# EAGLE design TesteTouchScreenadaptador28 (EAGLE 6.2)
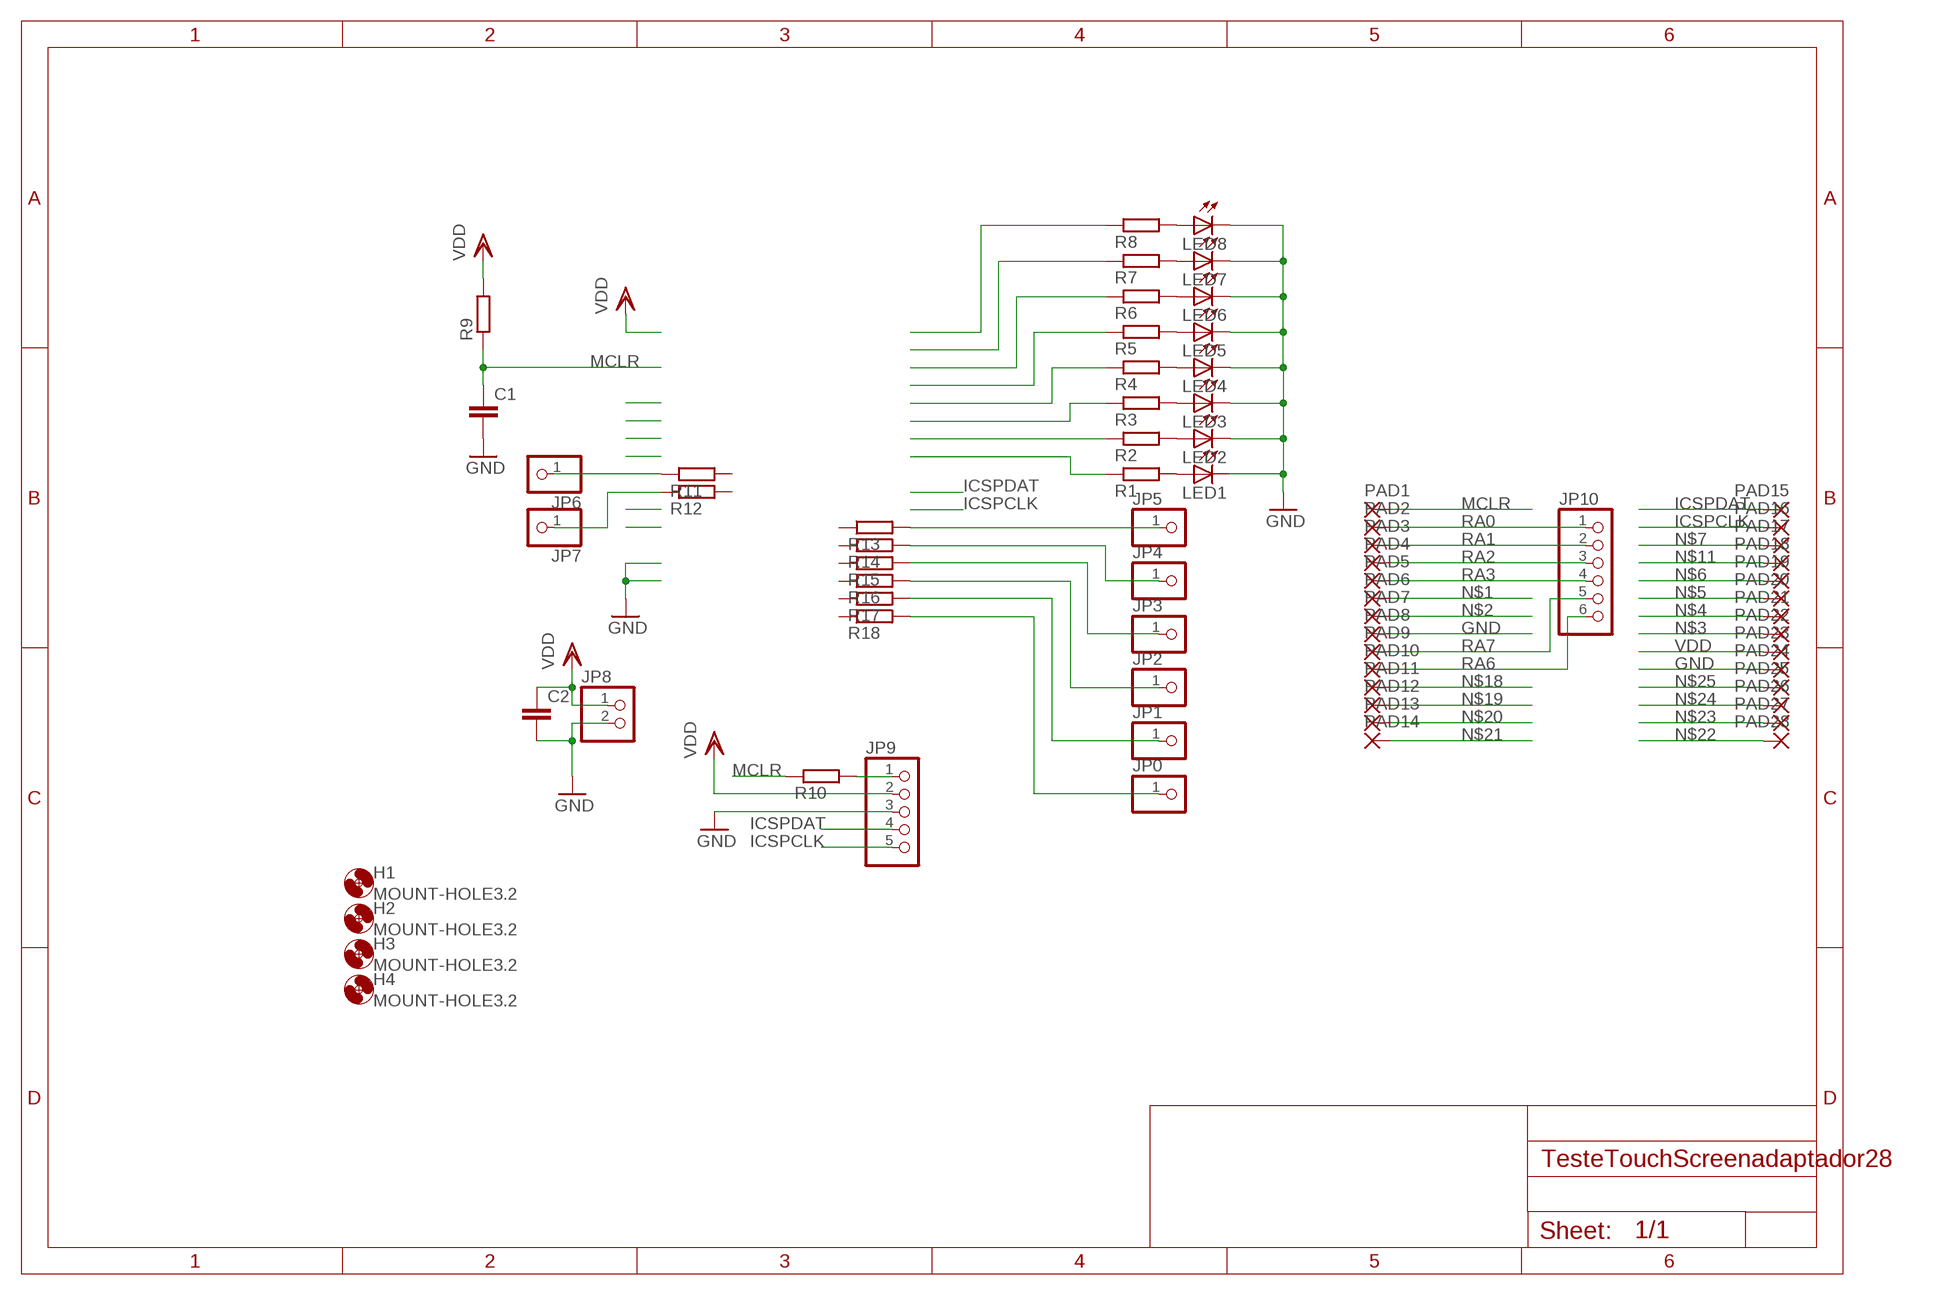
[diagram p0: schematic, sheet 1]

## Parts
C1  C-EUC1206  [C1206]
C2  C-EUC1206  [C1206]
H1  MOUNT-HOLE3.2  [3,2]
H2  MOUNT-HOLE3.2  [3,2]
H3  MOUNT-HOLE3.2  [3,2]
H4  MOUNT-HOLE3.2  [3,2]
JP0  PINHD-1X1  [1X01]
JP1  PINHD-1X1  [1X01]
JP2  PINHD-1X1  [1X01]
JP3  PINHD-1X1  [1X01]
JP4  PINHD-1X1  [1X01]
JP5  PINHD-1X1  [1X01]
JP6  PINHD-1X1  [1X01]
JP7  PINHD-1X1  [1X01]
JP8  PINHD-1X2  [1X02]
JP9  PINHD-1X5  [1X05]
JP10  PINHD-1X6  [1X06]
LED1  LED5MM  [LED5MM]
LED2  LED5MM  [LED5MM]
LED3  LED5MM  [LED5MM]
LED4  LED5MM  [LED5MM]
LED5  LED5MM  [LED5MM]
LED6  LED5MM  [LED5MM]
LED7  LED5MM  [LED5MM]
LED8  LED5MM  [LED5MM]
PAD1  SMD2  [SMD1,27-2,54]
PAD2  SMD2  [SMD1,27-2,54]
PAD3  SMD2  [SMD1,27-2,54]
PAD4  SMD2  [SMD1,27-2,54]
PAD5  SMD2  [SMD1,27-2,54]
PAD6  SMD2  [SMD1,27-2,54]
PAD7  SMD2  [SMD1,27-2,54]
PAD8  SMD2  [SMD1,27-2,54]
PAD9  SMD2  [SMD1,27-2,54]
PAD10  SMD2  [SMD1,27-2,54]
PAD11  SMD2  [SMD1,27-2,54]
PAD12  SMD2  [SMD1,27-2,54]
PAD13  SMD2  [SMD1,27-2,54]
PAD14  SMD2  [SMD1,27-2,54]
PAD15  SMD2  [SMD1,27-2,54]
PAD16  SMD2  [SMD1,27-2,54]
PAD17  SMD2  [SMD1,27-2,54]
PAD18  SMD2  [SMD1,27-2,54]
PAD19  SMD2  [SMD1,27-2,54]
PAD20  SMD2  [SMD1,27-2,54]
PAD21  SMD2  [SMD1,27-2,54]
PAD22  SMD2  [SMD1,27-2,54]
PAD23  SMD2  [SMD1,27-2,54]
PAD24  SMD2  [SMD1,27-2,54]
PAD25  SMD2  [SMD1,27-2,54]
PAD26  SMD2  [SMD1,27-2,54]
PAD27  SMD2  [SMD1,27-2,54]
PAD28  SMD2  [SMD1,27-2,54]
R1  R-EU_R0805  [R0805]
R2  R-EU_R0805  [R0805]
R3  R-EU_R0805  [R0805]
R4  R-EU_R0805  [R0805]
R5  R-EU_R0805  [R0805]
R6  R-EU_R0805  [R0805]
R7  R-EU_R0805  [R0805]
R8  R-EU_R0805  [R0805]
R9  R-EU_R0805  [R0805]
R10  R-EU_R0805  [R0805]
R11  R-EU_R0805  [R0805]
R12  R-EU_R0805  [R0805]
R13  R-EU_R0805  [R0805]
R14  R-EU_R0805  [R0805]
R15  R-EU_R0805  [R0805]
R16  R-EU_R0805  [R0805]
R17  R-EU_R0805  [R0805]
R18  R-EU_R0805  [R0805]

## Nets
GND: C1.2 C2.2 JP8.2 JP9.3 LED1.K(C) LED2.K(C) LED3.K(C) LED4.K(C) LED5.K(C) LED6.K(C) LED7.K(C) LED8.K(C) PAD8.1(P) PAD24.1(P)
ICSPCLK: JP9.5 PAD16.1(P)
ICSPDAT: JP9.4 PAD15.1(P)
MCLR: C1.1 PAD1.1(P) R9.1 R10.1
N$1: JP6.1 PAD6.1(P) R11.1
N$2: JP7.1 PAD7.1(P) R12.1
N$3: JP0.1 PAD22.1(P) R18.2
N$4: JP1.1 PAD21.1(P) R17.2
N$5: JP2.1 PAD20.1(P) R16.2
N$6: JP3.1 PAD19.1(P) R15.2
N$7: JP5.1 PAD17.1(P) R13.2
N$9: LED1.A R1.2
N$10: LED2.A R2.2
N$11: JP4.1 PAD18.1(P) R14.2
N$12: LED3.A R3.2
N$13: LED4.A R4.2
N$14: LED5.A R5.2
N$15: LED6.A R6.2
N$16: LED7.A R7.2
N$17: LED8.A R8.2
N$18: PAD11.1(P) R1.1
N$19: PAD12.1(P) R2.1
N$20: PAD13.1(P) R3.1
N$21: PAD14.1(P) R4.1
N$22: PAD28.1(P) R5.1
N$23: PAD27.1(P) R6.1
N$24: PAD26.1(P) R7.1
N$25: PAD25.1(P) R8.1
N$26: JP9.1 R10.2
RA0: JP10.1 PAD2.1(P)
RA1: JP10.2 PAD3.1(P)
RA2: JP10.3 PAD4.1(P)
RA3: JP10.4 PAD5.1(P)
RA6: JP10.6 PAD10.1(P)
RA7: JP10.5 PAD9.1(P)
VDD: C2.1 JP8.1 JP9.2 PAD23.1(P) R9.2
Unconnected: R11.2 R12.2 R13.1 R14.1 R15.1 R16.1 R17.1 R18.1

## Library data of the parts
C1 C2 = rcl:C-EU: CAPACITOR, European symbol
H1-H4 = holes:MOUNT-HOLE: MOUNTING HOLE with drill center marker
JP0 JP1-JP7 = pinhead:PINHD-1X1: PIN HEADER
JP8 = pinhead:PINHD-1X2: PIN HEADER
JP9 = pinhead:PINHD-1X5: PIN HEADER
JP10 = pinhead:PINHD-1X6: PIN HEADER
LED1-LED8 = led:LED: LED OSRAM: - CHIPLED LG R971, LG N971, LY N971, LG Q971, LY Q971, LO R971, LY R971 LH N974, LH R974 LS Q976, LO Q976, LY Q976 LO Q996 - Hyper CHIPLED LW Q18S LB Q993, LB Q99A, LB R99A - SideLED LS A670, LO A670, LY A670, LG A670, LP A670 LB A673, LV A673, LT A673, LW A673 LH A674 LY A675 LS A676, LA A676, LO A676, LY A676, LW A676 LS A679, LY A679, LG A679 - Hyper Micro SIDELED® LS Y876, LA Y876, LO Y876, LY Y876 LT Y87S - SmartLED LW L88C, LW L88S LB L89C, LB L89S, LG L890 LS L89K, LO L89K, LY L89K LS L896, LA L896, LO L896, LY L896 - TOPLED LS T670, LO T670, LY T670, LG T670, LP T670 LSG T670, LSP T670, LSY T670, LOP T670, LYG T670 LG T671, LOG T671, LSG T671 LB T673, LV T673, LT T673, LW T673 LH T674 LS T676, LA T676, LO T676, LY T676, LB T676, LH T676, LSB T676, LW T676 LB T67C, LV T67C, LT T67C, LS T67K, LO T67K, LY T67K, LW E67C LS E67B, LA E67B, LO E67B, LY E67B, LB E67C, LV E67C, LT E67C LW T67C LS T679, LY T679, LG T679 LS T770, LO T770, LY T770, LG T770, LP T770 LB T773, LV T773, LT T773, LW T773 LH T774 LS E675, LA E675, LY E675, LS T675 LS T776, LA T776, LO T776, LY T776, LB T776 LHGB T686 LT T68C, LB T68C - Hyper Mini TOPLED® LB M676 - Mini TOPLED Santana® LG M470 LS M47K, LO M47K, LY M47K Source: http://www.osram.convergy.de LUXEON: - LUMILED® LXK2-PW12-R00, LXK2-PW12-S00, LXK2-PW14-U00, LXK2-PW14-V00 LXK2-PM12-R00, LXK2-PM12-S00, LXK2-PM14-U00 LXK2-PE12-Q00, LXK2-PE12-R00, LXK2-PE12-S00, LXK2-PE14-T00, LXK2-PE14-U00 LXK2-PB12-K00, LXK2-PB12-L00, LXK2-PB12-M00, LXK2-PB14-N00, LXK2-PB14-P00, LXK2-PB14-Q00 LXK2-PR12-L00, LXK2-PR12-M00, LXK2-PR14-Q00, LXK2-PR14-R00 LXK2-PD12-Q00, LXK2-PD12-R00, LXK2-PD12-S00 LXK2-PH12-R00, LXK2-PH12-S00 LXK2-PL12-P00, LXK2-PL12-Q00, LXK2-PL12-R00 Source: www.luxeon.com KINGBRIGHT: KA-3528ASYC Source: www.kingbright.com
PAD1-PAD28 = wirepad:SMD2: SMD PAD
R1-R18 = rcl:R-EU_: RESISTOR, European symbol

## Board
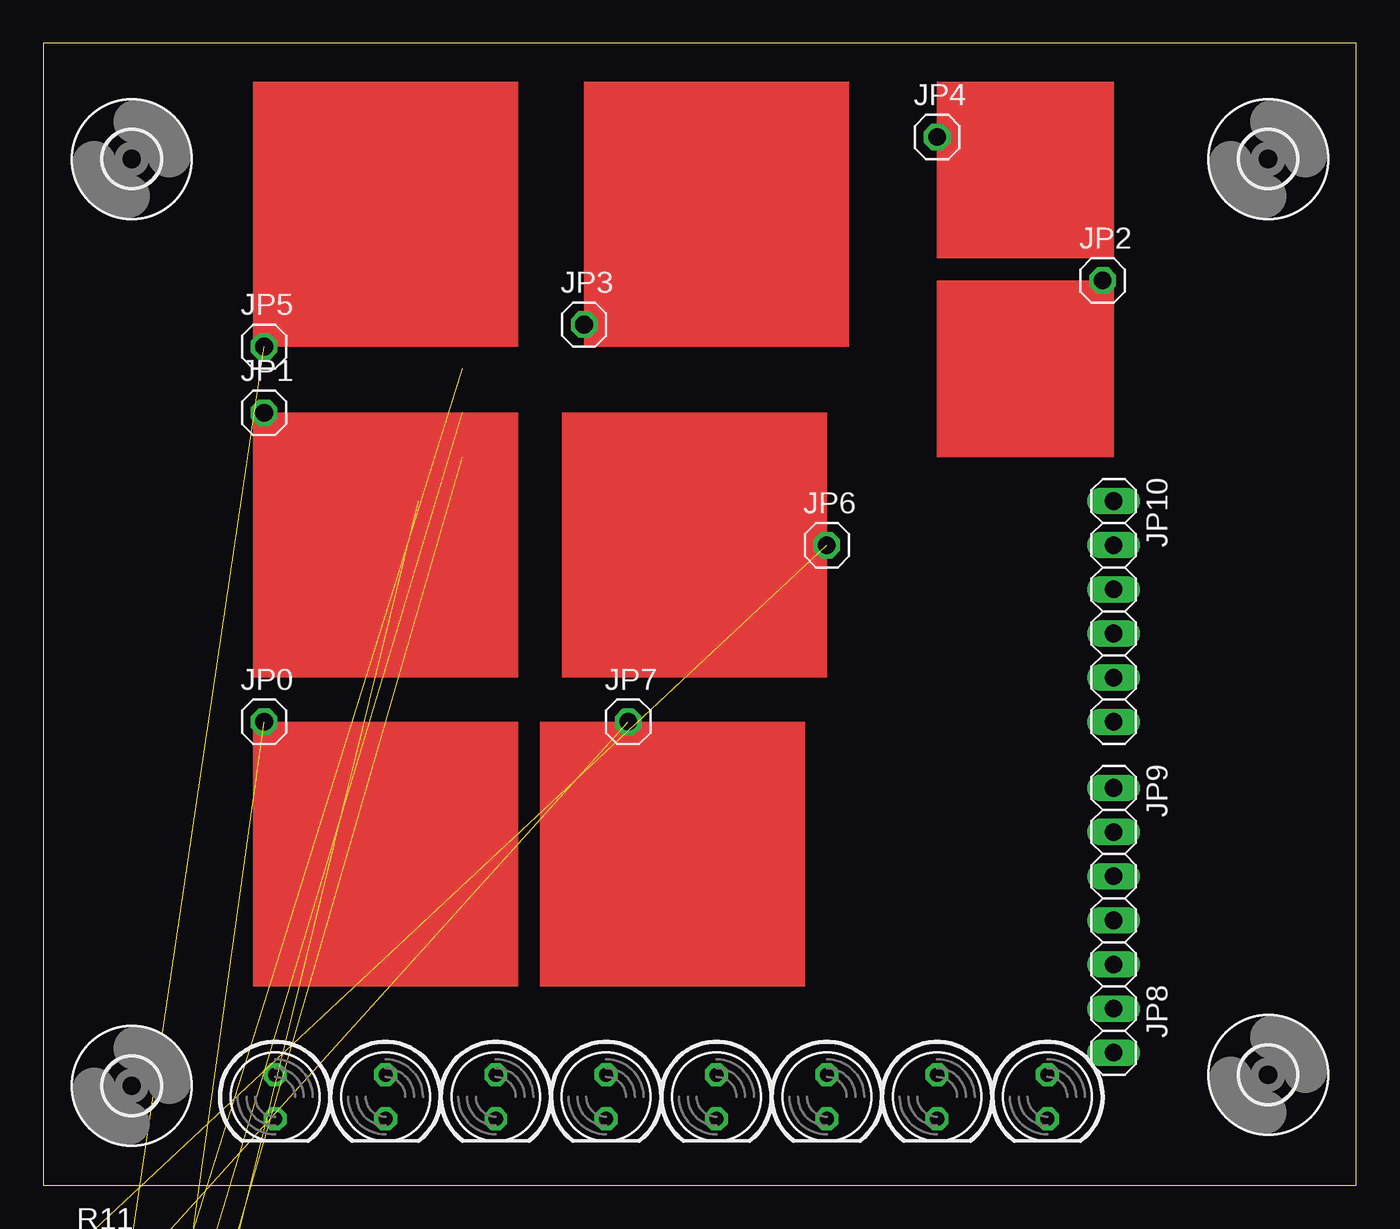
[diagram p1: board, top side]
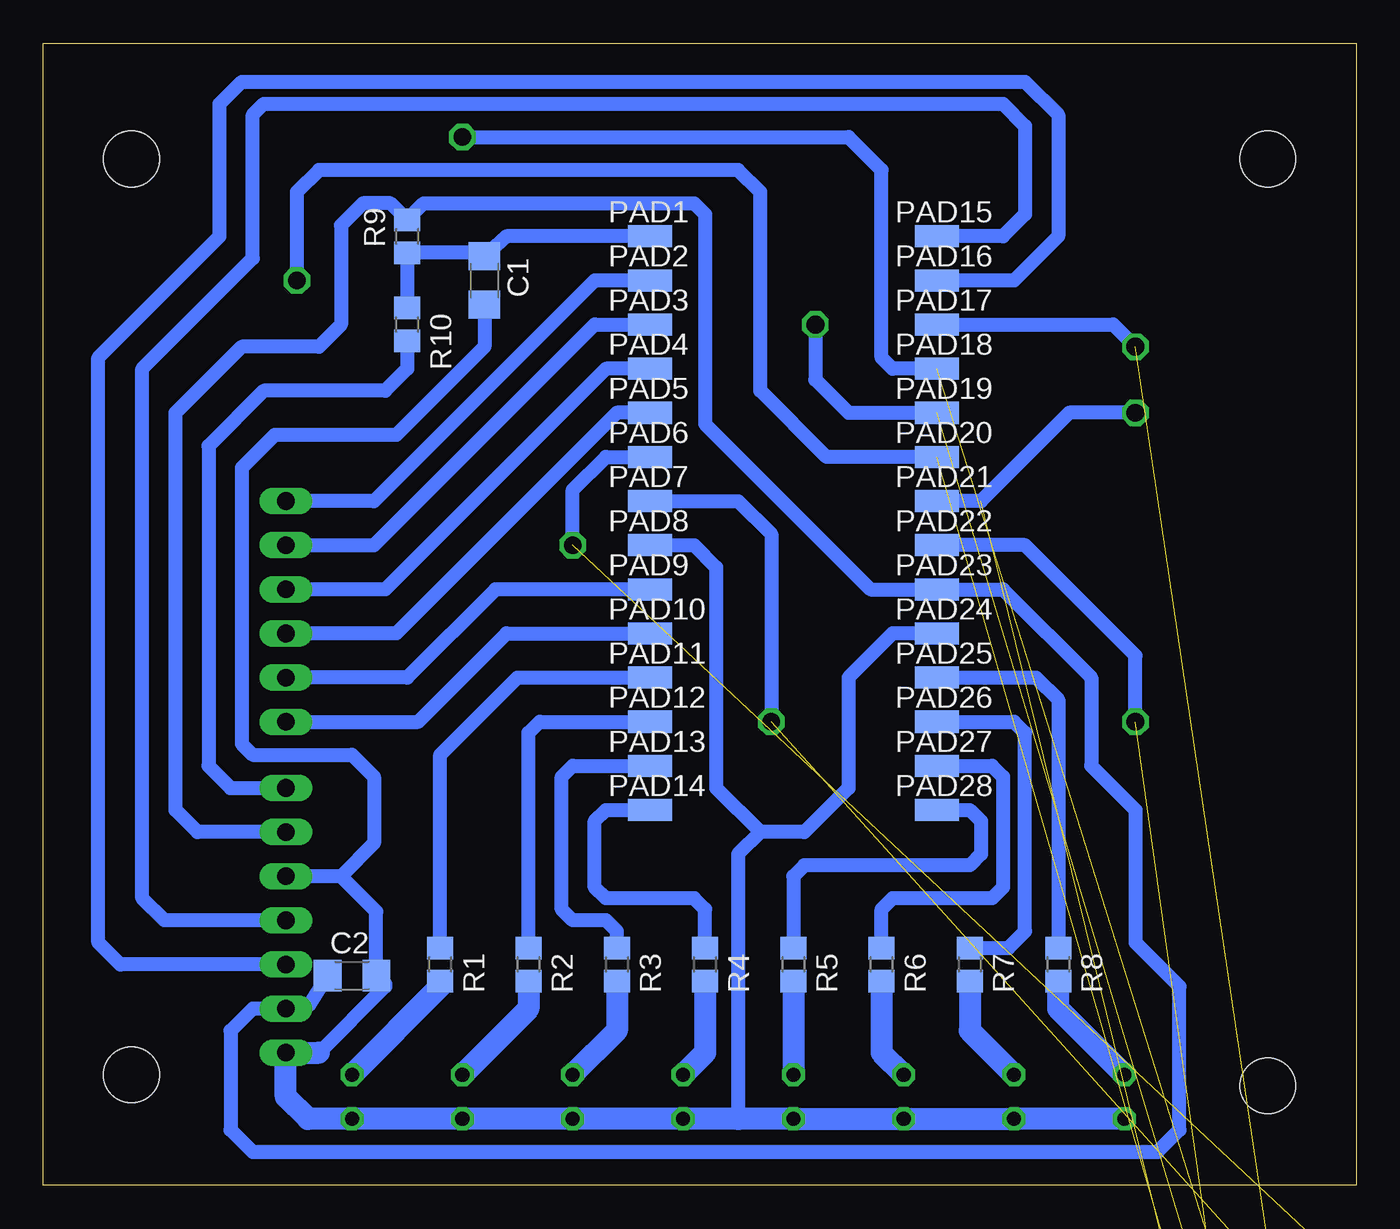
[diagram p2: board, bottom side, seen from below]

Size 75.55 x 65.71 mm. Coordinates in mm from the lower left corner, seen from the top.
Outline: 0,0 75.55,0 75.55,65.71 0,65.71 0,0
Copper layers (1*16): Top 0.035mm / dielectric 1.5mm / Bottom 0.035mm
Design rules: minimum track width 10mil, minimum drill 24mil, track to track 8mil, track to pad 8mil, pad to pad 8mil, via to via 8mil, smd to smd 8mil, copper to edge 40mil, drill to drill 8mil, minimum pad ring 10mil, minimum via ring 8mil, stop-mask expansion 4mil, vias tented up to drill 0mil, thermal gap 10mil

### Footprints (pad centres in the part's own frame; a part is rotated, then mirrored left to right if it is on the bottom)
C1206 = smd 1.6 x 1.8: 1 -1.4,0; 2 1.4,0
3,2 = hole 3.2: 0,0
1X01 = drill 1.016 octagon: 1 0,0
1X02 = drill 1.016 long: 1 -1.27,0; 2 1.27,0
1X05 = drill 1.016 long: 1 -5.08,0; 2 -2.54,0; 3 0,0; 4 2.54,0; 5 5.08,0
1X06 = drill 1.016 long: 1 -6.35,0; 2 -3.81,0; 3 -1.27,0; 4 1.27,0; 5 3.81,0; 6 6.35,0
LED5MM = drill 0.813 octagon: A -1.27,0; K 1.27,0
SMD1,27-2,54 = smd 1.27 x 2.54: 1 0,0
R0805 = smd 1.3 x 1.5: 1 -0.95,0; 2 0.95,0

### Placement (x,y rotation side)
C1  50.16,52.07 270 bottom
C2  57.78,12.06 0 bottom
H1  70.48,6.35 0 top
H2  70.48,59.05 0 top
H3  5.08,5.71 0 top
H4  5.08,59.05 0 top
JP0  12.7,26.67 0 top
JP1  12.7,44.45 0 top
JP2  60.96,52.07 0 top
JP3  31.11,49.53 0 top
JP4  51.44,60.33 0 top
JP5  12.7,48.26 0 top
JP6  45.09,36.83 0 top
JP7  33.66,26.67 0 top
JP8  61.59,8.89 270 top
JP9  61.59,17.78 270 top
JP10  61.59,33.02 270 top
LED1  57.78,5.08 270 top
LED2  51.44,5.08 270 top
LED3  45.09,5.08 270 top
LED4  38.73,5.08 270 top
LED5  32.38,5.08 270 top
LED6  26.04,5.08 270 top
LED7  19.68,5.08 270 top
LED8  13.34,5.08 270 top
PAD1  40.64,54.61 270 bottom
PAD2  40.64,52.07 270 bottom
PAD3  40.64,49.53 270 bottom
PAD4  40.64,46.99 270 bottom
PAD5  40.64,44.45 270 bottom
PAD6  40.64,41.91 270 bottom
PAD7  40.64,39.37 270 bottom
PAD8  40.64,36.83 270 bottom
PAD9  40.64,34.29 270 bottom
PAD10  40.64,31.75 270 bottom
PAD11  40.64,29.21 270 bottom
PAD12  40.64,26.67 270 bottom
PAD13  40.64,24.13 270 bottom
PAD14  40.64,21.59 270 bottom
PAD15  24.13,54.61 270 bottom
PAD16  24.13,52.07 270 bottom
PAD17  24.13,49.53 270 bottom
PAD18  24.13,46.99 270 bottom
PAD19  24.13,44.45 270 bottom
PAD20  24.13,41.91 270 bottom
PAD21  24.13,39.37 270 bottom
PAD22  24.13,36.83 270 bottom
PAD23  24.13,34.29 270 bottom
PAD24  24.13,31.75 270 bottom
PAD25  24.13,29.21 270 bottom
PAD26  24.13,26.67 270 bottom
PAD27  24.13,24.13 270 bottom
PAD28  24.13,21.59 270 bottom
R1  52.7,12.7 270 bottom
R2  47.62,12.7 270 bottom
R3  42.55,12.7 270 bottom
R4  37.47,12.7 270 bottom
R5  32.38,12.7 270 bottom
R6  27.3,12.7 270 bottom
R7  22.23,12.7 270 bottom
R8  17.14,12.7 270 bottom
R9  54.61,54.61 90 bottom
R10  54.61,49.53 270 bottom
R11  2.54,-3.81 0 top  (outside the outline)
R12  2.54,-8.89 0 top  (outside the outline)
R13  2.54,-13.97 0 top  (outside the outline)
R14  2.54,-19.05 0 top  (outside the outline)
R15  2.54,-24.13 0 top  (outside the outline)
R16  2.54,-29.21 0 top  (outside the outline)
R17  2.54,-34.29 0 top  (outside the outline)
R18  2.54,-39.37 0 top  (outside the outline)

### Tracks (layer width: path | path; a pad name or v marks a point on that pad's centre or on a via)
GND
  Bottom 0.813: 58.42,17.78 56.52,19.68 56.52,23.5 57.78,24.77 63.5,24.77 64.14,25.4 64.14,41.27 62.23,43.18 55.24,43.18 50.16,48.26 C1.2 | 58.42,17.78 JP9.3 | 58.42,17.78 56.38,15.74 C2.2 55.88,11.56 55.88,11.43 59.69,7.62 | PAD24.1 26.67,31.75 29.21,29.21 29.21,22.86 31.75,20.32 34.29,20.32 | PAD8.1 38.1,36.83 36.83,35.56 36.83,22.86 34.29,20.32 | 34.29,20.32 35.56,19.05 35.56,3.81
  Bottom 1.27: LED8.K LED7.K LED6.K LED5.K 35.56,3.81 LED4.K LED3.K LED2.K LED1.K 60.33,3.81 61.59,5.08 JP8.2 59.69,7.62
ICSPCLK
  Bottom 0.813: JP9.5 71.12,12.7 72.39,13.97 72.39,47.62 65.41,54.61 65.41,62.23 64.14,63.5 19.05,63.5 17.14,61.59 17.14,54.61 19.68,52.07 PAD16.1
ICSPDAT
  Bottom 0.813: JP9.4 68.58,15.24 69.85,16.51 69.85,46.99 63.5,53.34 63.5,61.59 62.87,62.23 20.32,62.23 19.05,60.96 19.05,55.88 20.32,54.61 PAD15.1
MCLR
  Bottom 0.813: PAD1.1 48.9,54.61 C1.1 50.35,53.66 R9.1 R10.1
N$1  (1 unrouted)
  Bottom 0.813: JP6.1 45.09,40.01 43.18,41.91 PAD6.1
N$2  (1 unrouted)
  Bottom 0.813: PAD7.1 35.56,39.37 33.66,37.47 JP7.1
N$3  (1 unrouted)
  Bottom 0.813: JP0.1 12.7,30.48 19.05,36.83 PAD22.1
N$4  (1 unrouted)
  Bottom 0.813: JP1.1 16.51,44.45 21.59,39.37 PAD21.1
N$5  (1 unrouted)
  Bottom 0.813: PAD20.1 30.48,41.91 34.29,45.72 34.29,57.15 35.56,58.42 59.69,58.42 60.96,57.15 JP2.1
N$6  (1 unrouted)
  Bottom 0.813: JP3.1 31.11,46.35 29.21,44.45 PAD19.1
N$7  (1 unrouted)
  Bottom 0.813: PAD17.1 13.97,49.53 JP5.1
N$9
  Bottom 1.27: R1.2 52.7,11.43 LED1.A
N$10
  Bottom 1.27: R2.2 47.62,10.16 LED2.A
N$11  (1 unrouted)
  Bottom 0.813: PAD18.1 26.67,46.99 27.3,47.62 27.3,58.42 29.21,60.33 JP4.1
N$12
  Bottom 1.27: R3.2 42.55,8.89 LED3.A
N$13
  Bottom 1.27: R4.2 37.47,7.62 LED4.A
N$14
  Bottom 1.27: R5.2 LED5.A
N$15
  Bottom 1.27: R6.2 27.3,7.62 LED6.A
N$16
  Bottom 1.27: R7.2 22.23,8.89 LED7.A
N$17
  Bottom 1.27: LED8.A 17.14,10.16 R8.2
N$18
  Bottom 0.813: R1.1 52.7,24.77 48.26,29.21 PAD11.1
N$19
  Bottom 0.813: R2.1 47.62,26.04 46.99,26.67 PAD12.1
N$20
  Bottom 0.813: R3.1 42.55,14.61 43.18,15.24 45.09,15.24 45.72,15.88 45.72,23.5 45.09,24.13 PAD13.1
N$21
  Bottom 0.813: R4.1 37.47,15.88 38.1,16.51 43.18,16.51 43.81,17.14 43.81,20.95 43.18,21.59 PAD14.1
N$22
  Bottom 0.813: PAD28.1 22.23,21.59 21.59,20.95 21.59,19.05 22.23,18.41 31.75,18.41 32.38,17.78 R5.1
N$23
  Bottom 0.813: PAD27.1 20.95,24.13 20.32,23.5 20.32,17.14 20.95,16.51 26.67,16.51 27.3,15.88 R6.1
N$24
  Bottom 0.813: PAD26.1 19.68,26.67 19.05,26.04 19.05,14.61 20,13.65 R7.1
N$25
  Bottom 0.813: PAD25.1 18.41,29.21 17.14,27.94 R8.1
N$26
  Bottom 0.813: R10.2 54.61,46.99 55.88,45.72 62.87,45.72 66.04,42.55 66.04,24.13 64.77,22.86 JP9.1
RA0
  Bottom 0.813: PAD2.1 43.81,52.07 56.52,39.37 JP10.1
RA1
  Bottom 0.813: JP10.2 56.52,36.83 43.81,49.53 PAD3.1
RA2
  Bottom 0.813: PAD4.1 43.18,46.99 55.88,34.29 JP10.3
RA3
  Bottom 0.813: PAD5.1 42.55,44.45 55.24,31.75 JP10.4
RA6
  Bottom 0.813: JP10.6 53.98,26.67 48.9,31.75 PAD10.1
RA7
  Bottom 0.813: PAD9.1 49.53,34.29 54.61,29.21 JP10.5
VDD
  Bottom 0.813: JP9.2 66.67,20.32 67.94,21.59 67.94,44.45 64.14,48.26 59.69,48.26 58.42,49.53 58.42,55.24 57.15,56.52 55.56,56.52 R9.2 53.66,56.52 38.1,56.52 37.47,55.88 37.47,43.81 27.94,34.29 PAD23.1 20.32,34.29 15.24,29.21 15.24,24.13 12.7,21.59 12.7,13.97 10.16,11.43 10.16,3.17 11.43,1.91 63.5,1.91 64.77,3.17 64.77,8.89 63.5,10.16 JP8.1 60.33,10.29 C2.1
(copper drawn outside any net)
  shapes: Top area x8